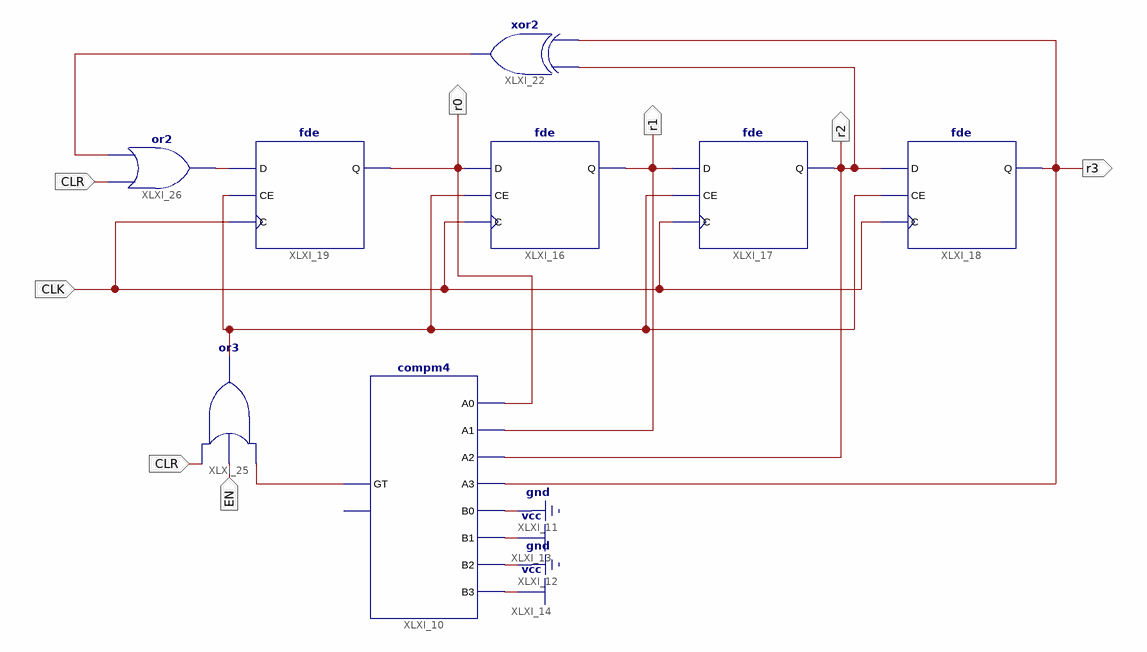
[diagram p0: schematic sheet 1]
// Xilinx ISE schematic random_design.sch (spartan3) as structural Verilog: 8 symbols, 7 ports
module random_design (
  input  EN,
  input  CLK,
  input  CLR,
  output r3,
  output r0,
  output r1,
  output r2
);

  wire XLXN_15, XLXN_23, XLXN_65, XLXN_66;

  compm4 XLXI_10 (
    .A0(r0), .A1(r1), .A2(r2), .A3(r3), .B0(1'b0), .B1(1'b1), .B2(1'b0), .B3(1'b1), .GT(XLXN_15));  // open: LT
  fde XLXI_16 (.C(CLK), .CE(XLXN_23), .D(r0), .Q(r1));
  fde XLXI_17 (.C(CLK), .CE(XLXN_23), .D(r1), .Q(r2));
  fde XLXI_18 (.C(CLK), .CE(XLXN_23), .D(r2), .Q(r3));
  fde XLXI_19 (.C(CLK), .CE(XLXN_23), .D(XLXN_65), .Q(r0));
  xor XLXI_22 (XLXN_66, r2, r3);
  or XLXI_25 (XLXN_23, XLXN_15, EN, CLR);
  or XLXI_26 (XLXN_65, CLR, XLXN_66);
endmodule
